# EAGLE schematic lllc (EAGLE 7.7.0)

## Sheet 1 of 2
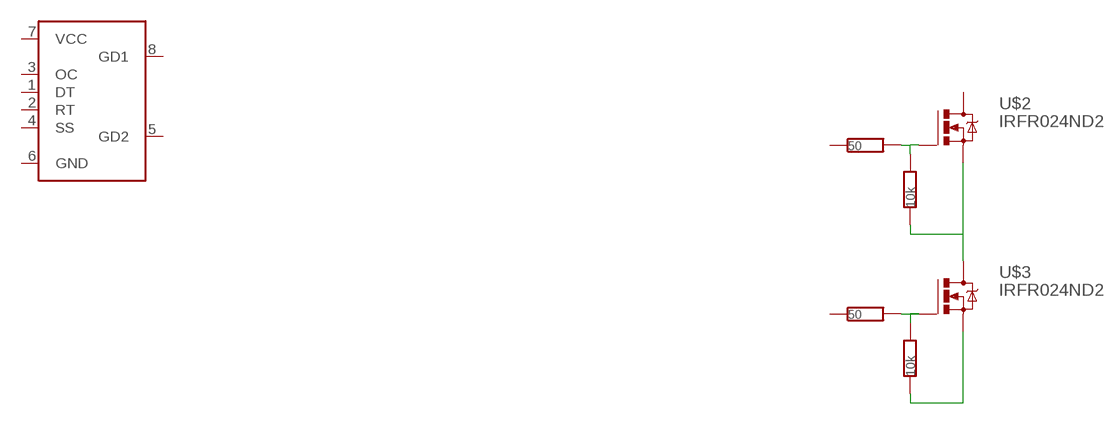
[diagram p0: schematic, sheet 1]

### Parts
R1  50  R0805  [R0805]
R2  50  R0805  [R0805]
R3  10k  R0805  [R0805]
R4  10k  R0805  [R0805]
U$1  TPS92020  [SO08]
U$2  IRFR024ND2  [D2PACK]
U$3  IRFR024ND2  [D2PACK]

### Nets
N$1: R3.1 U$2.3(S) U$3.2(D)
N$2: R1.2 R3.2 U$2.1(G)
N$3: R2.2 R4.2 U$3.1(G)
N$4: R4.1 U$3.3(S)
Unconnected: R1.1 R2.1 U$1.1(DT) U$1.2(RT) U$1.3(OC) U$1.4(SS) U$1.5(GD2) U$1.6(GND) U$1.7(VCC) U$1.8(GD1) U$2.2(D)

## Sheet 2 of 2

## Library data of the parts
R1-R4 = CasaLibrary:R
U$1 = CasaLibrary:TPS92020
U$2 U$3 = CasaLibrary:IRFR024N